# EAGLE schematic Shutdown Circuit Schematic (EAGLE 9.6.2)
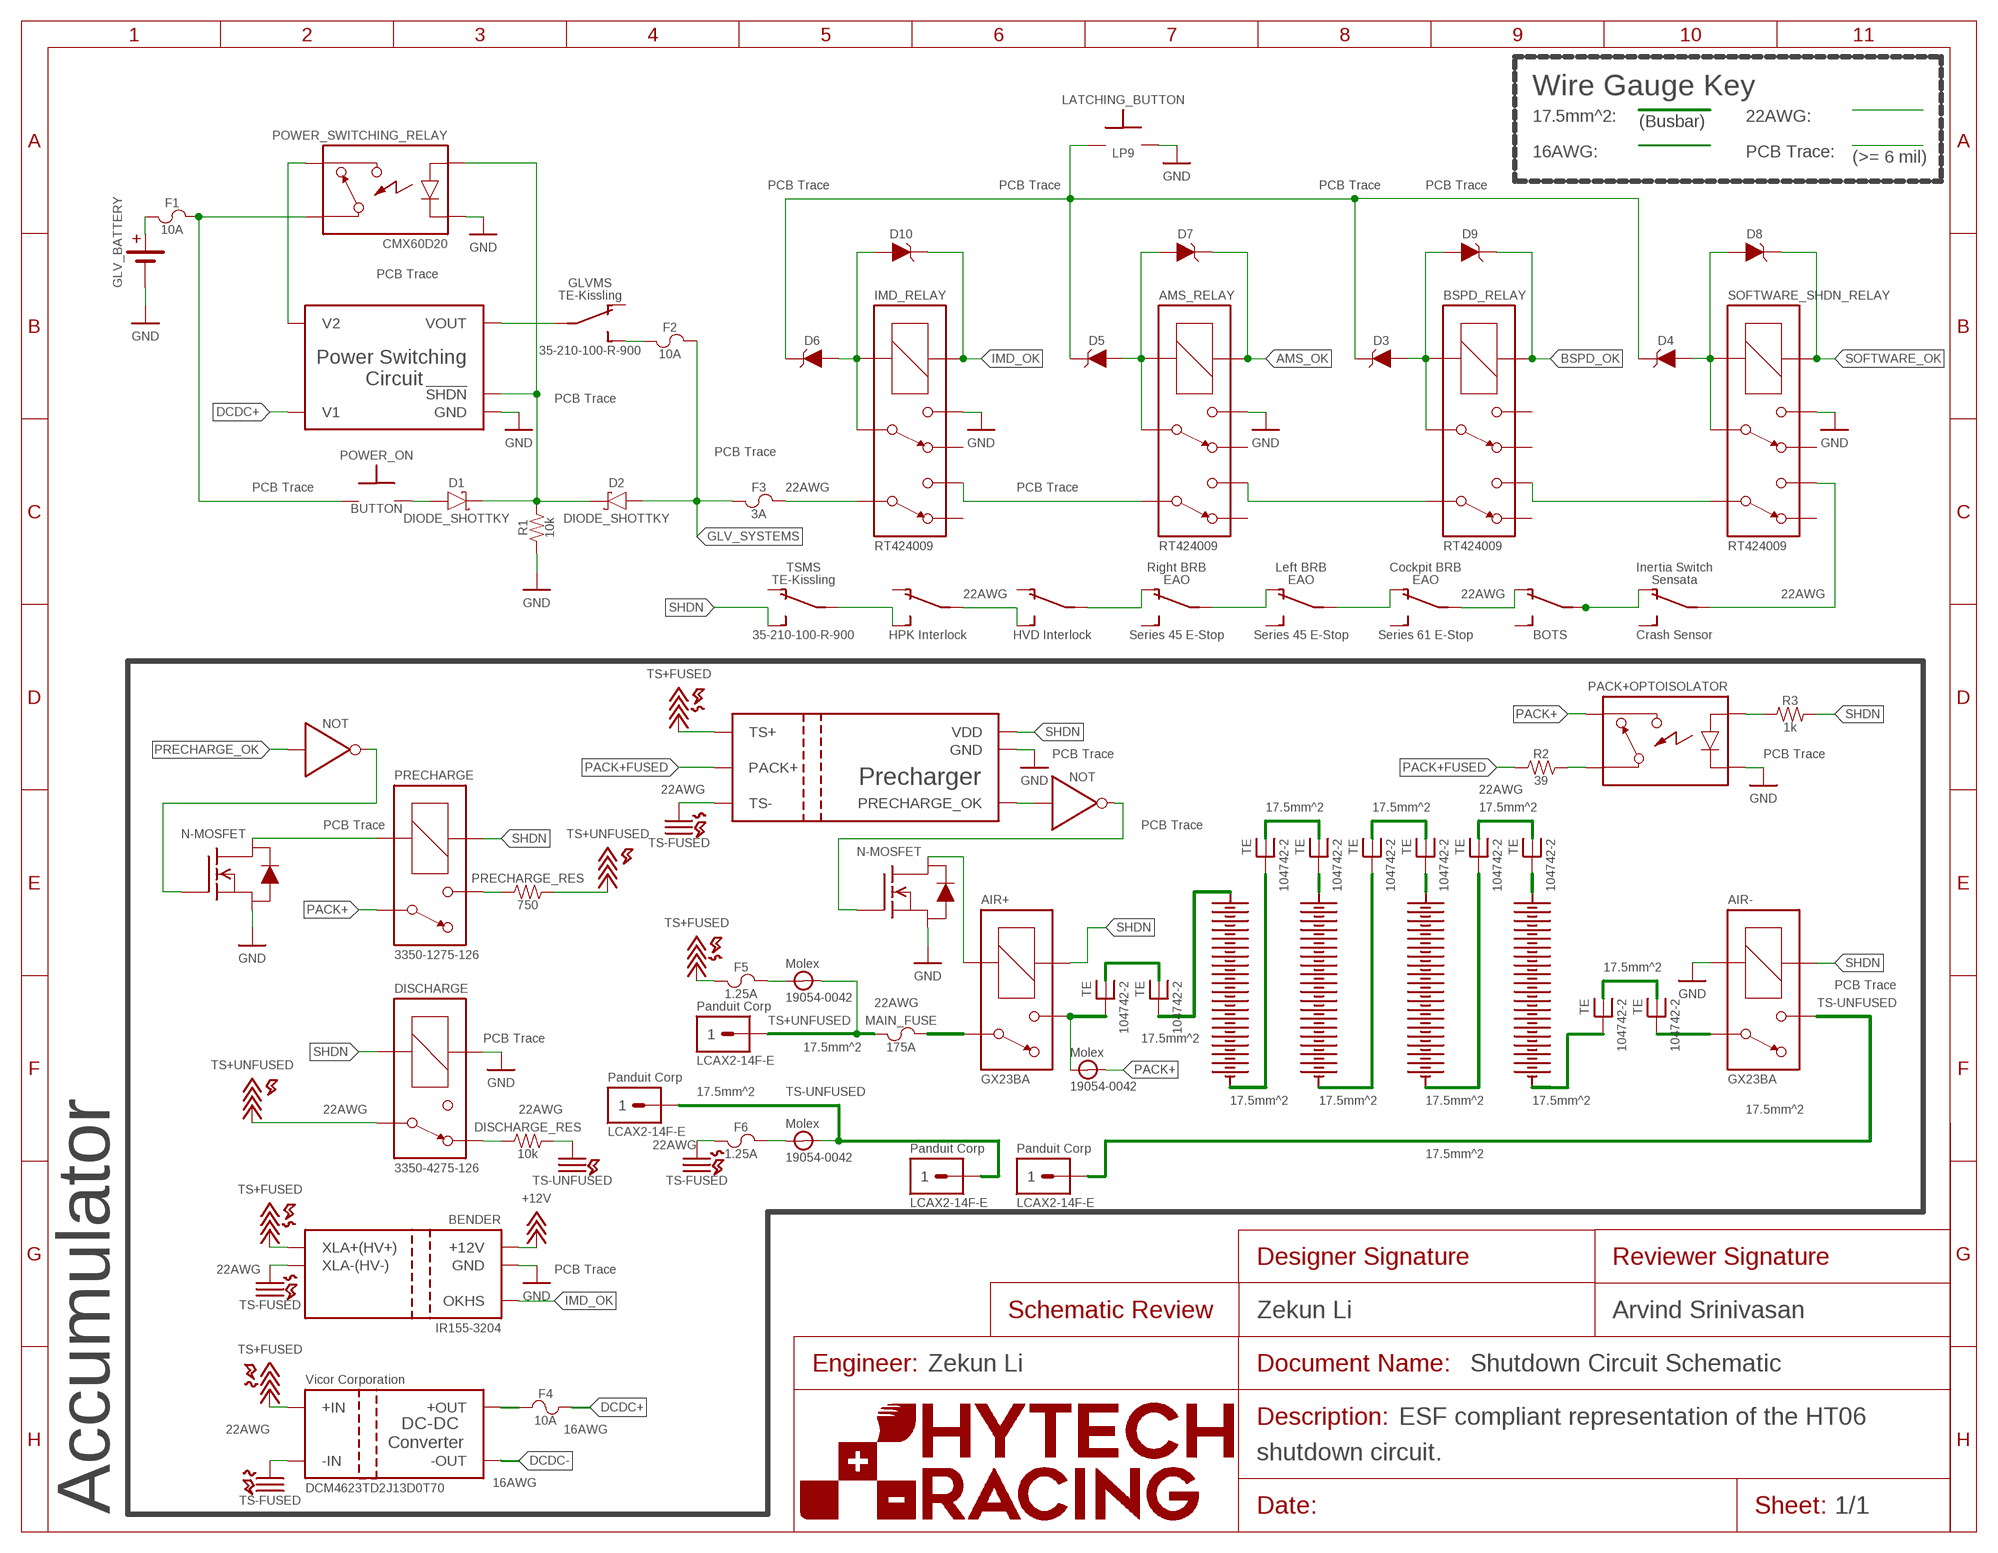
[diagram p0: schematic, sheet 1]
U$16 (FRAME_SCHEMATIC_ONLY): DESCRIPTION_1: ESF compliant representation of the HT06; DESCRIPTION_2: shutdown circuit.; DESIGNER_SCHEMATIC: Zekun Li; ENGINEER: Zekun Li; REVIEWER_SCHEMATIC: Arvind Srinivasan

## Parts
AIR+  RELAY_SPST_NO_GX23BA  (no package)
AIR-  RELAY_SPST_NO_GX23BA  (no package)
AMS_RELAY  RELAY_DPDT_RT424009  (no package)
BSPD_RELAY  RELAY_DPDT_RT424009  (no package)
D1  DIODE_SHOTTKY  (no package)
D2  DIODE_SHOTTKY  (no package)
D3  DIODE  (no package)
D4  DIODE  (no package)
D5  DIODE  (no package)
D6  DIODE  (no package)
D7  DIODE  (no package)
D8  DIODE  (no package)
D9  DIODE  (no package)
D10  DIODE  (no package)
DISCHARGE  RELAY_SPST_NC_3350-4275-126  (no package)
DISCHARGE_RES  10k  RESISTOR  (no package)
F1  10A  FUSE  (no package)
F2  10A  FUSE  (no package)
F3  3A  FUSE  (no package)
F4  10A  FUSE  (no package)
F5  1.25A  FUSE  (no package)
F6  1.25A  FUSE  (no package)
GLV_BATTERY  BATTERY  (no package)
IMD_RELAY  RELAY_DPDT_RT424009  (no package)
J1  CONNECTOR-1_LCAX2-14F-E  (no package)
J2  CONNECTOR-1_LCAX2-14F-E  (no package)
J3  CONNECTOR-1_LCAX2-14F-E  (no package)
J4  CONNECTOR-1_LCAX2-14F-E  (no package)
LATCHING_BUTTON  BUTTON_NO_LP9  (no package)
MAIN_FUSE  175A  FUSE  (no package)
PACK+OPTOISOLATOR  RELAY_SOLIDSTATE_NO_  (no package)
POWER_ON  BUTTON_NO  (no package)
POWER_SWITCHING_RELAY  RELAY_SOLIDSTATE_NO_CMX60D20  (no package)
PRECHARGE  RELAY_SPST_NO_3350-1275-126  (no package)
PRECHARGE_RES  750  RESISTOR  (no package)
Q1  MOSFET_N-CHANNEL  (no package)
Q2  MOSFET_N-CHANNEL  (no package)
R1  10k  RESISTOR  (no package)
R2  39  RESISTOR  (no package)
R3  1k  RESISTOR  (no package)
S1  SWITCH_SPST_INERTIA_SWITCH  (no package)
S2  SWITCH_SPST_  (no package)
S3  SWITCH_SPST_27MM_STOP  (no package)
S4  SWITCH_SPST_40MM_STOP  (no package)
S5  SWITCH_SPST_40MM_STOP  (no package)
S6  SWITCH_SPST_  (no package)
S7  SWITCH_SPST_  (no package)
S8  SWITCH_SPST_35-210-100-R-900  (no package)
S9  SWITCH_SPST_35-210-100-R-900  (no package)
SOFTWARE_SHDN_RELAY  RELAY_DPDT_RT424009  (no package)
U1  LOGICGATE_INVERTER  (no package)
U2  LOGICGATE_INVERTER  (no package)
U$1  DC-DC_CONVERTER_DCM4623TD2J13D0T70  (no package)
U$9  POWER_SWITCHING_BOARD  (no package)
U$10  BENDER_IR155-3204  (no package)
U$12  SEGMENT  (no package)
U$13  SEGMENT  (no package)
U$14  SEGMENT  (no package)
U$15  SEGMENT  (no package)
U$17  PRECHARGER  (no package)
U$20  MAINTENANCE_PLUG_104742-2  (no package)
U$21  MAINTENANCE_PLUG_104742-2  (no package)
U$22  MAINTENANCE_PLUG_104742-2  (no package)
U$23  MAINTENANCE_PLUG_104742-2  (no package)
U$24  MAINTENANCE_PLUG_104742-2  (no package)
U$25  MAINTENANCE_PLUG_104742-2  (no package)
U$34  MAINTENANCE_PLUG_104742-2  (no package)
U$35  MAINTENANCE_PLUG_104742-2  (no package)
U$36  MAINTENANCE_PLUG_104742-2  (no package)
U$37  MAINTENANCE_PLUG_104742-2  (no package)
U$38  RING_TERMINAL_19054-0042  (no package)
U$39  RING_TERMINAL_19054-0042  (no package)
U$40  RING_TERMINAL_19054-0042  (no package)

## Nets
+12V: U$10.+12V
AMS_OK: AMS_RELAY.COIL+ D7.C
BSPD_OK: BSPD_RELAY.COIL+ D9.C
DCDC+: F4.1 U$9.V1
DCDC-: U$1.-OUT
GLV_SYSTEMS: D2.A F2.2 F3.1
GND: AIR-.COIL+ AMS_RELAY.4 DISCHARGE.COIL- GLV_BATTERY.P$2 IMD_RELAY.4 LATCHING_BUTTON.P$2 PACK+OPTOISOLATOR.CONTROL- POWER_SWITCHING_RELAY.CONTROL- Q1.S Q2.S R1.1 SOFTWARE_SHDN_RELAY.4 U$9.GND U$10.GND U$17.GND
IMD_OK: D10.C IMD_RELAY.COIL+ U$10.OKHS
N$1: D6.A D10.A IMD_RELAY.3 IMD_RELAY.COIL-
N$2: D3.C D4.C D5.C D6.C LATCHING_BUTTON.P$1
N$3: AMS_RELAY.3 AMS_RELAY.COIL- D5.A D7.A
N$4: S1.O S2.P
N$5: D4.A D8.A SOFTWARE_SHDN_RELAY.3 SOFTWARE_SHDN_RELAY.COIL-
N$6: BSPD_RELAY.3 BSPD_RELAY.COIL- D3.A D9.A
N$7: S1.P SOFTWARE_SHDN_RELAY.5
N$8: S3.O S4.P
N$9: S2.O S3.P
N$10: AMS_RELAY.5 BSPD_RELAY.6
N$11: AMS_RELAY.6 IMD_RELAY.5
N$12: S4.O S5.P
N$13: S5.O S6.P
N$14: F1.1 GLV_BATTERY.P$1
N$15: F1.2 POWER_ON.P$1 POWER_SWITCHING_RELAY.CONTACT1
N$16: POWER_SWITCHING_RELAY.CONTACT2 U$9.V2
N$17: D1.C D2.C POWER_SWITCHING_RELAY.CONTROL+ R1.2 U$9.!SHDN
N$18: S9.P U$9.VOUT
N$19: D1.A POWER_ON.P$2
N$20: F2.1 S9.S
N$21: S6.S S7.P
N$22: F3.2 IMD_RELAY.6
N$23: U$15.- U$36.1
N$24: Q1.G U1.!IN
N$25: U2.IN U$17.PRECHARGE_OK
N$26: PRECHARGE.CONTACT2 PRECHARGE_RES.1
N$29: DISCHARGE.CONTACT2 DISCHARGE_RES.1
N$30: F4.2 U$1.+OUT
N$31: U$12.- U$20.1
N$32: U$13.+ U$21.1
N$33: U$13.- U$22.1
N$34: U$14.+ U$23.1
N$35: U$14.- U$24.1
N$36: U$15.+ U$25.1
N$37: U$34.P$1 U$35.P$1
N$38: AIR+.CONTACT2 U$34.1 U$40.P$1
N$39: PACK+OPTOISOLATOR.CONTROL+ R3.1
N$40: PACK+OPTOISOLATOR.CONTACT1 R2.2
N$42: BSPD_RELAY.5 SOFTWARE_SHDN_RELAY.6
N$43: U$20.P$1 U$21.P$1
N$44: U$22.P$1 U$23.P$1
N$45: U$24.P$1 U$25.P$1
N$46: U$36.P$1 U$37.P$1
N$47: AIR-.CONTACT1 U$37.1
N$48: F6.2 U$38.P$1
N$50: F5.2 U$39.P$1
N$51: S7.S S8.P
N$52: Q2.G U2.!IN
N$53: AIR+.COIL+ Q2.D
PACK+: PACK+OPTOISOLATOR.CONTACT2 PRECHARGE.CONTACT1 U$12.+ U$35.1 U$40.P$2
PACK+FUSED: R2.1 U$17.PACK+
PRECHARGE_OK: PRECHARGE.COIL+ Q1.D U1.IN
SHDN: AIR+.COIL- AIR-.COIL- DISCHARGE.COIL+ PRECHARGE.COIL- R3.2 S8.S U$17.VDD
SOFTWARE_OK: D8.C SOFTWARE_SHDN_RELAY.COIL+
TS+: F5.1 U$1.+IN U$10.XLA+(HV+) U$17.TS+ ; supply symbol labelled TS+FUSED
TS+UNFUSED: AIR+.CONTACT1 DISCHARGE.CONTACT1 J2.1 MAIN_FUSE.1 MAIN_FUSE.2 PRECHARGE_RES.2 U$39.P$2
TS-UNFUSED: AIR-.CONTACT2 DISCHARGE_RES.2 F6.1 J1.1 J3.1 J4.1 U$1.-IN U$10.XLA-(HV-) U$17.TS- U$38.P$2 ; supply symbol labelled TS-FUSED
Unconnected: AMS_RELAY.2 AMS_RELAY.7 BSPD_RELAY.2 BSPD_RELAY.4 BSPD_RELAY.7 IMD_RELAY.2 IMD_RELAY.7 S1.S S2.S S3.S S4.S S5.S S6.O S7.O S8.O S9.O SOFTWARE_SHDN_RELAY.2 SOFTWARE_SHDN_RELAY.7

## Notes on the sheet
- Wire Gauge Key
- 17.5mm^2: | 22AWG:
- (Busbar)
- 16AWG: | PCB Trace:
- (>= 6 mil)
- PCB Trace | PCB Trace | PCB Trace | PCB Trace
- PCB Trace
- GLVMS
- PCB Trace
- PCB Trace
- PCB Trace | 22AWG | PCB Trace
- TSMS | Right BRB | Left BRB | Cockpit BRB | Inertia Switch
- 22AWG | 22AWG | 22AWG
- PCB Trace | PCB Trace
- 22AWG | 22AWG
- 17.5mm^2 | 17.5mm^2 | 17.5mm^2
- PCB Trace | PCB Trace
- 17.5mm^2
- PCB Trace
- 22AWG
- PCB Trace | 17.5mm^2
- 17.5mm^2
- 17.5mm^2
- 22AWG | 22AWG | 17.5mm^2 | 17.5mm^2 | 17.5mm^2 | 17.5mm^2 | 17.5mm^2
- 22AWG
- 17.5mm^2
- 22AWG | PCB Trace
- 22AWG | 16AWG
- 16AWG
- Accumulator

## Library data of the parts
AIR+ AIR- = HyTechSymbolsTemp:RELAY_SPST_NO_?*: Single pole single throw normally open relay 3350-1275-126 <https://drive.google.com/file/d/1L0NeZqCX2TFaVQbwFxpbbu9uMJSPuulv/view> GX23BA <https://drive.google.com/file/d/1Ccq0vir690jgHxUhztItQKfgtS51YNj_/view>; MANUFACTURER: Gigavac; MPN: GX23BA
AMS_RELAY BSPD_RELAY IMD_RELAY SOFTWARE_SHDN_RELAY = HyTechSymbolsTemp:RELAY_DPDT_?*: Dual pole dual throw relay RT424009 <https://drive.google.com/file/d/12KcB2gZ1-F85lC-w8KP3F9yHGxVaqaUc/view>; MANUFACTURER: TE Connectivity Potter & Brumfield Relays; MPN: RT424009
D1 D2 = HyTechSymbolsTemp:DIODE_SHOTTKY
D3-D10 = HyTechSymbolsTemp:DIODE
DISCHARGE = HyTechSymbolsTemp:RELAY_SPST_NC_?*: Single pole single throw normally closed relay 3350-4275-126 <https://drive.google.com/file/d/1L0NeZqCX2TFaVQbwFxpbbu9uMJSPuulv/view>; MANUFACTURER: Comus; MPN: 3350-4275-126
DISCHARGE_RES PRECHARGE_RES R1-R3 = HyTechSymbolsTemp:RESISTOR
F1-F6 MAIN_FUSE = HyTechSymbolsTemp:FUSE
GLV_BATTERY = HyTechSymbols:BATTERY
J1-J4 = HyTechSymbolsTemp:CONNECTOR-1_*: Single pin connector CT2242-2 <https://drive.google.com/file/d/1rFz1F44pFGMLks1TuzNftb-wQBk0xWUD/view> LCAX2-14F-E <https://drive.google.com/file/d/1bbvHAAOUtBwm4fAPUWES_iBsARNVuAgN/view>; MANUFACTURER: Panduit Corp; MPN: LCAX2-14F-E
LATCHING_BUTTON = HyTechSymbolsTemp:BUTTON_NO_*: Normally open pushbutton OTTO P9 Series Pushbutton Switches <https://www.mouser.com/datasheet/2/603/P9_Sealed_Dome_Pushbuttons_Catalog_Pages-2576938.pdf> OTTO LP9 Series Illuminated Pushbutton Switches <https://www.otto-controls.com/-/media/products/electromechanical-switches/pushbuttonswitches/lp9illuminatedsealedmomentaryactionpushbuttonswitch/LP9-Pushbuttons-Catalog-Pages.ashx>; MANUFACTURER: OTTO; MPN: LP9
PACK+OPTOISOLATOR = HyTechSymbolsTemp:RELAY_SOLIDSTATE_NO_*: Solid-state single pole single throw normally open relay CMX60D20 <https://drive.google.com/file/d/11HaAODTxMI5zJ0hT5nquYCFtw3_aAMfR/view>
POWER_ON = HyTechSymbolsTemp:BUTTON_NO
POWER_SWITCHING_RELAY = HyTechSymbolsTemp:RELAY_SOLIDSTATE_NO_*: Solid-state single pole single throw normally open relay CMX60D20 <https://drive.google.com/file/d/11HaAODTxMI5zJ0hT5nquYCFtw3_aAMfR/view>; MANUFACTURER: Crydom; MPN: CMX60D20
PRECHARGE = HyTechSymbolsTemp:RELAY_SPST_NO_?*: Single pole single throw normally open relay 3350-1275-126 <https://drive.google.com/file/d/1L0NeZqCX2TFaVQbwFxpbbu9uMJSPuulv/view> GX23BA <https://drive.google.com/file/d/1Ccq0vir690jgHxUhztItQKfgtS51YNj_/view>; MANUFACTURER: Comus; MPN: 3350-1275-126
Q1 Q2 = HyTechSymbolsTemp:MOSFET_N-CHANNEL
S1 = HyTechSymbols:SWITCH_SPST_*: Single Pull Single Throw Switch EAO Series 61 27mm Illuminated Emergency Stop Swtich <https://eao.com/fileadmin/documents/PDFs/en/03_brochures/EAO_PB_61_E-Stop_Compact_EN.pdf> EAO Series 45 40mm Illuminated Emergency Stop Swtich <https://hmi.eao.com/p/965f6719> EAO Series 45 34mm Illuminated Emergency Stop Switch <https://hmi.eao.com/p/5909b34f> TE Battery Disconnector Switch <https://www.mouser.com/datasheet/2/418/8/ENG_CD_35_210_100_R_900_5-2533843.pdf>; MANUFACTURER: Sensata; MPN: Crash Sensor
S2 = HyTechSymbols:SWITCH_SPST_*: Single Pull Single Throw Switch EAO Series 61 27mm Illuminated Emergency Stop Swtich <https://eao.com/fileadmin/documents/PDFs/en/03_brochures/EAO_PB_61_E-Stop_Compact_EN.pdf> EAO Series 45 40mm Illuminated Emergency Stop Swtich <https://hmi.eao.com/p/965f6719> EAO Series 45 34mm Illuminated Emergency Stop Switch <https://hmi.eao.com/p/5909b34f> TE Battery Disconnector Switch <https://www.mouser.com/datasheet/2/418/8/ENG_CD_35_210_100_R_900_5-2533843.pdf>; MPN: BOTS
S3 = HyTechSymbols:SWITCH_SPST_*: Single Pull Single Throw Switch EAO Series 61 27mm Illuminated Emergency Stop Swtich <https://eao.com/fileadmin/documents/PDFs/en/03_brochures/EAO_PB_61_E-Stop_Compact_EN.pdf> EAO Series 45 40mm Illuminated Emergency Stop Swtich <https://hmi.eao.com/p/965f6719> EAO Series 45 34mm Illuminated Emergency Stop Switch <https://hmi.eao.com/p/5909b34f> TE Battery Disconnector Switch <https://www.mouser.com/datasheet/2/418/8/ENG_CD_35_210_100_R_900_5-2533843.pdf>; MANUFACTURER: EAO; MPN: Series 61 E-Stop
S4 S5 = HyTechSymbols:SWITCH_SPST_*: Single Pull Single Throw Switch EAO Series 61 27mm Illuminated Emergency Stop Swtich <https://eao.com/fileadmin/documents/PDFs/en/03_brochures/EAO_PB_61_E-Stop_Compact_EN.pdf> EAO Series 45 40mm Illuminated Emergency Stop Swtich <https://hmi.eao.com/p/965f6719> EAO Series 45 34mm Illuminated Emergency Stop Switch <https://hmi.eao.com/p/5909b34f> TE Battery Disconnector Switch <https://www.mouser.com/datasheet/2/418/8/ENG_CD_35_210_100_R_900_5-2533843.pdf>; MANUFACTURER: EAO; MPN: Series 45 E-Stop
S6 = HyTechSymbols:SWITCH_SPST_*: Single Pull Single Throw Switch EAO Series 61 27mm Illuminated Emergency Stop Swtich <https://eao.com/fileadmin/documents/PDFs/en/03_brochures/EAO_PB_61_E-Stop_Compact_EN.pdf> EAO Series 45 40mm Illuminated Emergency Stop Swtich <https://hmi.eao.com/p/965f6719> EAO Series 45 34mm Illuminated Emergency Stop Switch <https://hmi.eao.com/p/5909b34f> TE Battery Disconnector Switch <https://www.mouser.com/datasheet/2/418/8/ENG_CD_35_210_100_R_900_5-2533843.pdf>; MPN: HVD Interlock
S7 = HyTechSymbols:SWITCH_SPST_*: Single Pull Single Throw Switch EAO Series 61 27mm Illuminated Emergency Stop Swtich <https://eao.com/fileadmin/documents/PDFs/en/03_brochures/EAO_PB_61_E-Stop_Compact_EN.pdf> EAO Series 45 40mm Illuminated Emergency Stop Swtich <https://hmi.eao.com/p/965f6719> EAO Series 45 34mm Illuminated Emergency Stop Switch <https://hmi.eao.com/p/5909b34f> TE Battery Disconnector Switch <https://www.mouser.com/datasheet/2/418/8/ENG_CD_35_210_100_R_900_5-2533843.pdf>; MPN: HPK Interlock
S8 S9 = HyTechSymbols:SWITCH_SPST_*: Single Pull Single Throw Switch EAO Series 61 27mm Illuminated Emergency Stop Swtich <https://eao.com/fileadmin/documents/PDFs/en/03_brochures/EAO_PB_61_E-Stop_Compact_EN.pdf> EAO Series 45 40mm Illuminated Emergency Stop Swtich <https://hmi.eao.com/p/965f6719> EAO Series 45 34mm Illuminated Emergency Stop Switch <https://hmi.eao.com/p/5909b34f> TE Battery Disconnector Switch <https://www.mouser.com/datasheet/2/418/8/ENG_CD_35_210_100_R_900_5-2533843.pdf>; MANUFACTURER: TE-Kissling; MPN: 35-210-100-R-900
U1 U2 = HyTechSymbolsTemp:LOGICGATE_INVERTER
U$1 = HyTechSymbols:DC-DC_CONVERTER_*: DC_DC Converter Vicor DCM Series <https://www.mouser.com/datasheet/2/685/DCM4623xD2J13D0y7z_ds-1144763.pdf>; MANUFACTURER: Vicor Corporation; MPN: DCM4623TD2J13D0T70
U$9 = HyTechSymbols:POWER_SWITCHING_BOARD
U$10 = HyTechSymbols:BENDER_IR155-3204: Bender IR155-3204 Insulation Monitoring Device Datasheet <http://www.bender-es.com/fileadmin/products/doc/IR155-32xx-V004_D00115_D_XXEN.pdf>
U$12-U$15 = HyTechSymbols:SEGMENT
U$17 = HyTechSymbolsTemp:PRECHARGER: Block representation of the HT06 precharger.
U$20-U$25 U$34-U$37 = HyTechSymbolsTemp:MAINTENANCE_PLUG_*; MANUFACTURER: TE; MPN: 104742-2
U$38-U$40 = HyTechSymbolsTemp:RING_TERMINAL_*: Ring terminal 19054-0042 <https://drive.google.com/drive/folders/1JhKTbRtwaszOvYIb3y-YkBSe0CyrUopM>; MANUFACTURER: Molex; MPN: 19054-0042